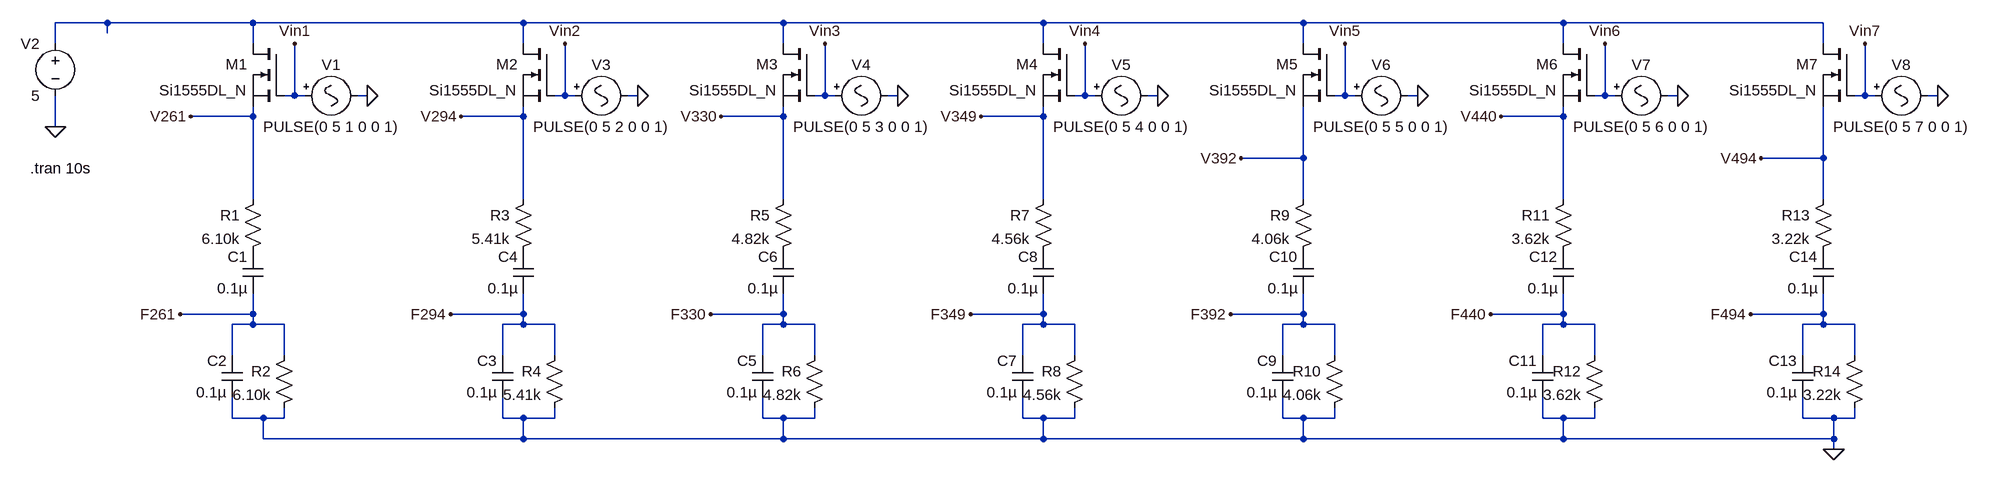
[diagram p0: schematic Pure_PWL_input.asc]
Pure_PWL_input.asc, the LTspice schematic file:
Version 4
SHEET 1 880 680
WIRE -2208 -400 -2288 -400
WIRE -1984 -400 -2208 -400
WIRE -1568 -400 -1984 -400
WIRE -1168 -400 -1568 -400
WIRE -768 -400 -1168 -400
WIRE -368 -400 -768 -400
WIRE 32 -400 -368 -400
WIRE 432 -400 32 -400
WIRE -2208 -384 -2208 -400
WIRE -2288 -368 -2288 -400
WIRE -1984 -368 -1984 -400
WIRE -1568 -368 -1568 -400
WIRE -1168 -368 -1168 -400
WIRE -768 -368 -768 -400
WIRE -368 -368 -368 -400
WIRE 32 -368 32 -400
WIRE 432 -368 432 -400
WIRE -1920 -288 -1920 -368
WIRE -1920 -288 -1936 -288
WIRE -1904 -288 -1920 -288
WIRE -1808 -288 -1824 -288
WIRE -1504 -288 -1504 -368
WIRE -1504 -288 -1520 -288
WIRE -1488 -288 -1504 -288
WIRE -1392 -288 -1408 -288
WIRE -1104 -288 -1104 -368
WIRE -1104 -288 -1120 -288
WIRE -1088 -288 -1104 -288
WIRE -992 -288 -1008 -288
WIRE -704 -288 -704 -368
WIRE -704 -288 -720 -288
WIRE -688 -288 -704 -288
WIRE -592 -288 -608 -288
WIRE -304 -288 -304 -368
WIRE -304 -288 -320 -288
WIRE -288 -288 -304 -288
WIRE -192 -288 -208 -288
WIRE 96 -288 96 -368
WIRE 96 -288 80 -288
WIRE 112 -288 96 -288
WIRE 208 -288 192 -288
WIRE 496 -288 496 -368
WIRE 496 -288 480 -288
WIRE 512 -288 496 -288
WIRE 608 -288 592 -288
WIRE -1984 -256 -1984 -272
WIRE -1984 -256 -2080 -256
WIRE -1568 -256 -1568 -272
WIRE -1568 -256 -1664 -256
WIRE -1168 -256 -1168 -272
WIRE -1168 -256 -1264 -256
WIRE -768 -256 -768 -272
WIRE -768 -256 -864 -256
WIRE 32 -256 32 -272
WIRE 32 -256 -64 -256
WIRE -2288 -240 -2288 -288
WIRE -368 -192 -368 -272
WIRE -368 -192 -464 -192
WIRE 432 -192 432 -272
WIRE 432 -192 336 -192
WIRE -1984 -128 -1984 -256
WIRE -1568 -128 -1568 -256
WIRE -1168 -128 -1168 -256
WIRE -768 -128 -768 -256
WIRE -368 -128 -368 -192
WIRE 32 -128 32 -256
WIRE 432 -128 432 -192
WIRE -1984 48 -1984 16
WIRE -1984 48 -2096 48
WIRE -1568 48 -1568 16
WIRE -1568 48 -1680 48
WIRE -1168 48 -1168 16
WIRE -1168 48 -1280 48
WIRE -768 48 -768 16
WIRE -768 48 -880 48
WIRE -368 48 -368 16
WIRE -368 48 -480 48
WIRE 32 48 32 16
WIRE 32 48 -80 48
WIRE 432 48 432 16
WIRE 432 48 320 48
WIRE -1984 64 -1984 48
WIRE -1984 64 -2016 64
WIRE -1936 64 -1984 64
WIRE -1568 64 -1568 48
WIRE -1568 64 -1600 64
WIRE -1520 64 -1568 64
WIRE -1168 64 -1168 48
WIRE -1168 64 -1200 64
WIRE -1120 64 -1168 64
WIRE -768 64 -768 48
WIRE -768 64 -800 64
WIRE -720 64 -768 64
WIRE -368 64 -368 48
WIRE -368 64 -400 64
WIRE -320 64 -368 64
WIRE 32 64 32 48
WIRE 32 64 0 64
WIRE 80 64 32 64
WIRE 432 64 432 48
WIRE 432 64 400 64
WIRE 480 64 432 64
WIRE -2016 112 -2016 64
WIRE -1936 112 -1936 64
WIRE -1600 112 -1600 64
WIRE -1520 112 -1520 64
WIRE -1200 112 -1200 64
WIRE -1120 112 -1120 64
WIRE -800 112 -800 64
WIRE -720 112 -720 64
WIRE -400 112 -400 64
WIRE -320 112 -320 64
WIRE 0 112 0 64
WIRE 80 112 80 64
WIRE 400 112 400 64
WIRE 480 112 480 64
WIRE -2016 208 -2016 176
WIRE -1968 208 -2016 208
WIRE -1936 208 -1936 192
WIRE -1936 208 -1968 208
WIRE -1600 208 -1600 176
WIRE -1568 208 -1600 208
WIRE -1520 208 -1520 192
WIRE -1520 208 -1568 208
WIRE -1200 208 -1200 176
WIRE -1168 208 -1200 208
WIRE -1120 208 -1120 192
WIRE -1120 208 -1168 208
WIRE -800 208 -800 176
WIRE -768 208 -800 208
WIRE -720 208 -720 192
WIRE -720 208 -768 208
WIRE -400 208 -400 176
WIRE -368 208 -400 208
WIRE -320 208 -320 192
WIRE -320 208 -368 208
WIRE 0 208 0 176
WIRE 32 208 0 208
WIRE 80 208 80 192
WIRE 80 208 32 208
WIRE 400 208 400 176
WIRE 448 208 400 208
WIRE 480 208 480 192
WIRE 480 208 448 208
WIRE -1968 240 -1968 208
WIRE -1568 240 -1568 208
WIRE -1568 240 -1968 240
WIRE -1168 240 -1168 208
WIRE -1168 240 -1568 240
WIRE -768 240 -768 208
WIRE -768 240 -1168 240
WIRE -368 240 -368 208
WIRE -368 240 -768 240
WIRE 32 240 32 208
WIRE 32 240 -368 240
WIRE 448 240 448 208
WIRE 448 240 32 240
WIRE 448 256 448 240
FLAG -1808 -288 0
FLAG -2288 -240 0
FLAG -1920 -368 Vin1
FLAG -2080 -256 V261
FLAG 448 256 0
FLAG -2096 48 F261
FLAG -1392 -288 0
FLAG -1504 -368 Vin2
FLAG -1664 -256 V294
FLAG -1680 48 F294
FLAG -992 -288 0
FLAG -1104 -368 Vin3
FLAG -1264 -256 V330
FLAG -1280 48 F330
FLAG -592 -288 0
FLAG -704 -368 Vin4
FLAG -864 -256 V349
FLAG -880 48 F349
FLAG -192 -288 0
FLAG -304 -368 Vin5
FLAG -464 -192 V392
FLAG -480 48 F392
FLAG 208 -288 0
FLAG 96 -368 Vin6
FLAG -64 -256 V440
FLAG -80 48 F440
FLAG 608 -288 0
FLAG 496 -368 Vin7
FLAG 336 -192 V494
FLAG 320 48 F494
SYMBOL Misc\\signal -1920 -288 M90
WINDOW 0 -32 56 VBottom 2
WINDOW 3 32 56 VTop 2
WINDOW 123 0 0 Left 0
WINDOW 39 0 0 Left 0
SYMATTR InstName V1
SYMATTR Value PULSE(0 5 1 0 0 1)
SYMBOL res -1968 -144 M0
SYMATTR InstName R1
SYMATTR Value 6.10k
SYMBOL nmos -1936 -368 M0
SYMATTR InstName M1
SYMATTR Value Si1555DL_N
SYMBOL voltage -2288 -384 M0
WINDOW 123 0 0 Left 0
WINDOW 39 0 0 Left 0
SYMATTR InstName V2
SYMATTR Value 5
SYMBOL res -1920 96 M0
SYMATTR InstName R2
SYMATTR Value 6.10k
SYMBOL cap -2000 112 M0
SYMATTR InstName C2
SYMATTR Value 0.1µ
SYMBOL cap -1968 -48 M0
SYMATTR InstName C1
SYMATTR Value 0.1µ
SYMBOL Misc\\signal -1504 -288 M90
WINDOW 0 -32 56 VBottom 2
WINDOW 3 32 56 VTop 2
WINDOW 123 0 0 Left 0
WINDOW 39 0 0 Left 0
SYMATTR InstName V3
SYMATTR Value PULSE(0 5 2 0 0 1)
SYMBOL res -1552 -144 M0
SYMATTR InstName R3
SYMATTR Value 5.41k
SYMBOL nmos -1520 -368 M0
SYMATTR InstName M2
SYMATTR Value Si1555DL_N
SYMBOL res -1504 96 M0
SYMATTR InstName R4
SYMATTR Value 5.41k
SYMBOL cap -1584 112 M0
SYMATTR InstName C3
SYMATTR Value 0.1µ
SYMBOL cap -1552 -48 M0
SYMATTR InstName C4
SYMATTR Value 0.1µ
SYMBOL Misc\\signal -1104 -288 M90
WINDOW 0 -32 56 VBottom 2
WINDOW 3 32 56 VTop 2
WINDOW 123 0 0 Left 0
WINDOW 39 0 0 Left 0
SYMATTR InstName V4
SYMATTR Value PULSE(0 5 3 0 0 1)
SYMBOL res -1152 -144 M0
SYMATTR InstName R5
SYMATTR Value 4.82k
SYMBOL nmos -1120 -368 M0
SYMATTR InstName M3
SYMATTR Value Si1555DL_N
SYMBOL res -1104 96 M0
SYMATTR InstName R6
SYMATTR Value 4.82k
SYMBOL cap -1184 112 M0
SYMATTR InstName C5
SYMATTR Value 0.1µ
SYMBOL cap -1152 -48 M0
SYMATTR InstName C6
SYMATTR Value 0.1µ
SYMBOL Misc\\signal -704 -288 M90
WINDOW 0 -32 56 VBottom 2
WINDOW 3 32 56 VTop 2
WINDOW 123 0 0 Left 0
WINDOW 39 0 0 Left 0
SYMATTR InstName V5
SYMATTR Value PULSE(0 5 4 0 0 1)
SYMBOL res -752 -144 M0
SYMATTR InstName R7
SYMATTR Value 4.56k
SYMBOL nmos -720 -368 M0
SYMATTR InstName M4
SYMATTR Value Si1555DL_N
SYMBOL res -704 96 M0
SYMATTR InstName R8
SYMATTR Value 4.56k
SYMBOL cap -784 112 M0
SYMATTR InstName C7
SYMATTR Value 0.1µ
SYMBOL cap -752 -48 M0
SYMATTR InstName C8
SYMATTR Value 0.1µ
SYMBOL Misc\\signal -304 -288 M90
WINDOW 0 -32 56 VBottom 2
WINDOW 3 32 56 VTop 2
WINDOW 123 0 0 Left 0
WINDOW 39 0 0 Left 0
SYMATTR InstName V6
SYMATTR Value PULSE(0 5 5 0 0 1)
SYMBOL res -352 -144 M0
SYMATTR InstName R9
SYMATTR Value 4.06k
SYMBOL nmos -320 -368 M0
SYMATTR InstName M5
SYMATTR Value Si1555DL_N
SYMBOL res -304 96 M0
SYMATTR InstName R10
SYMATTR Value 4.06k
SYMBOL cap -384 112 M0
SYMATTR InstName C9
SYMATTR Value 0.1µ
SYMBOL cap -352 -48 M0
SYMATTR InstName C10
SYMATTR Value 0.1µ
SYMBOL Misc\\signal 96 -288 M90
WINDOW 0 -32 56 VBottom 2
WINDOW 3 32 56 VTop 2
WINDOW 123 0 0 Left 0
WINDOW 39 0 0 Left 0
SYMATTR InstName V7
SYMATTR Value PULSE(0 5 6 0 0 1)
SYMBOL res 48 -144 M0
SYMATTR InstName R11
SYMATTR Value 3.62k
SYMBOL nmos 80 -368 M0
SYMATTR InstName M6
SYMATTR Value Si1555DL_N
SYMBOL res 96 96 M0
SYMATTR InstName R12
SYMATTR Value 3.62k
SYMBOL cap 16 112 M0
SYMATTR InstName C11
SYMATTR Value 0.1µ
SYMBOL cap 48 -48 M0
SYMATTR InstName C12
SYMATTR Value 0.1µ
SYMBOL Misc\\signal 496 -288 M90
WINDOW 0 -32 56 VBottom 2
WINDOW 3 32 56 VTop 2
WINDOW 123 0 0 Left 0
WINDOW 39 0 0 Left 0
SYMATTR InstName V8
SYMATTR Value PULSE(0 5 7 0 0 1)
SYMBOL res 448 -144 M0
SYMATTR InstName R13
SYMATTR Value 3.22k
SYMBOL nmos 480 -368 M0
SYMATTR InstName M7
SYMATTR Value Si1555DL_N
SYMBOL res 496 96 M0
SYMATTR InstName R14
SYMATTR Value 3.22k
SYMBOL cap 416 112 M0
SYMATTR InstName C13
SYMATTR Value 0.1µ
SYMBOL cap 448 -48 M0
SYMATTR InstName C14
SYMATTR Value 0.1µ
TEXT -2232 -176 Right 2 !.tran 10s

The netlist it stands for:
* Pure_PWL_input.asc
V1 Vin1 0 PULSE(0 5 1 0 0 1)
R1 V261 P001 6.10k
M1 N001 Vin1 V261 V261 Si1555DL_N
V2 N001 0 5
R2 F261 0 6.10k
C2 F261 0 0.1µ
C1 P001 F261 0.1µ
V3 Vin2 0 PULSE(0 5 2 0 0 1)
R3 V294 P002 5.41k
M2 N001 Vin2 V294 V294 Si1555DL_N
R4 F294 0 5.41k
C3 F294 0 0.1µ
C4 P002 F294 0.1µ
V4 Vin3 0 PULSE(0 5 3 0 0 1)
R5 V330 P003 4.82k
M3 N001 Vin3 V330 V330 Si1555DL_N
R6 F330 0 4.82k
C5 F330 0 0.1µ
C6 P003 F330 0.1µ
V5 Vin4 0 PULSE(0 5 4 0 0 1)
R7 V349 P004 4.56k
M4 N001 Vin4 V349 V349 Si1555DL_N
R8 F349 0 4.56k
C7 F349 0 0.1µ
C8 P004 F349 0.1µ
V6 Vin5 0 PULSE(0 5 5 0 0 1)
R9 V392 P005 4.06k
M5 N001 Vin5 V392 V392 Si1555DL_N
R10 F392 0 4.06k
C9 F392 0 0.1µ
C10 P005 F392 0.1µ
V7 Vin6 0 PULSE(0 5 6 0 0 1)
R11 V440 P006 3.62k
M6 N001 Vin6 V440 V440 Si1555DL_N
R12 F440 0 3.62k
C11 F440 0 0.1µ
C12 P006 F440 0.1µ
V8 Vin7 0 PULSE(0 5 7 0 0 1)
R13 V494 P007 3.22k
M7 N001 Vin7 V494 V494 Si1555DL_N
R14 F494 0 3.22k
C13 F494 0 0.1µ
C14 P007 F494 0.1µ
.model NMOS NMOS
.model PMOS PMOS
.lib standard.mos
.tran 10s
.backanno
.end